# Altium schematic sheet Power_Sheet.SchDoc: Power Sheet
size A4; DrawnBy: Project_Vega_Team; Revision: 1; SheetNumber: 3; SheetTotal: 7
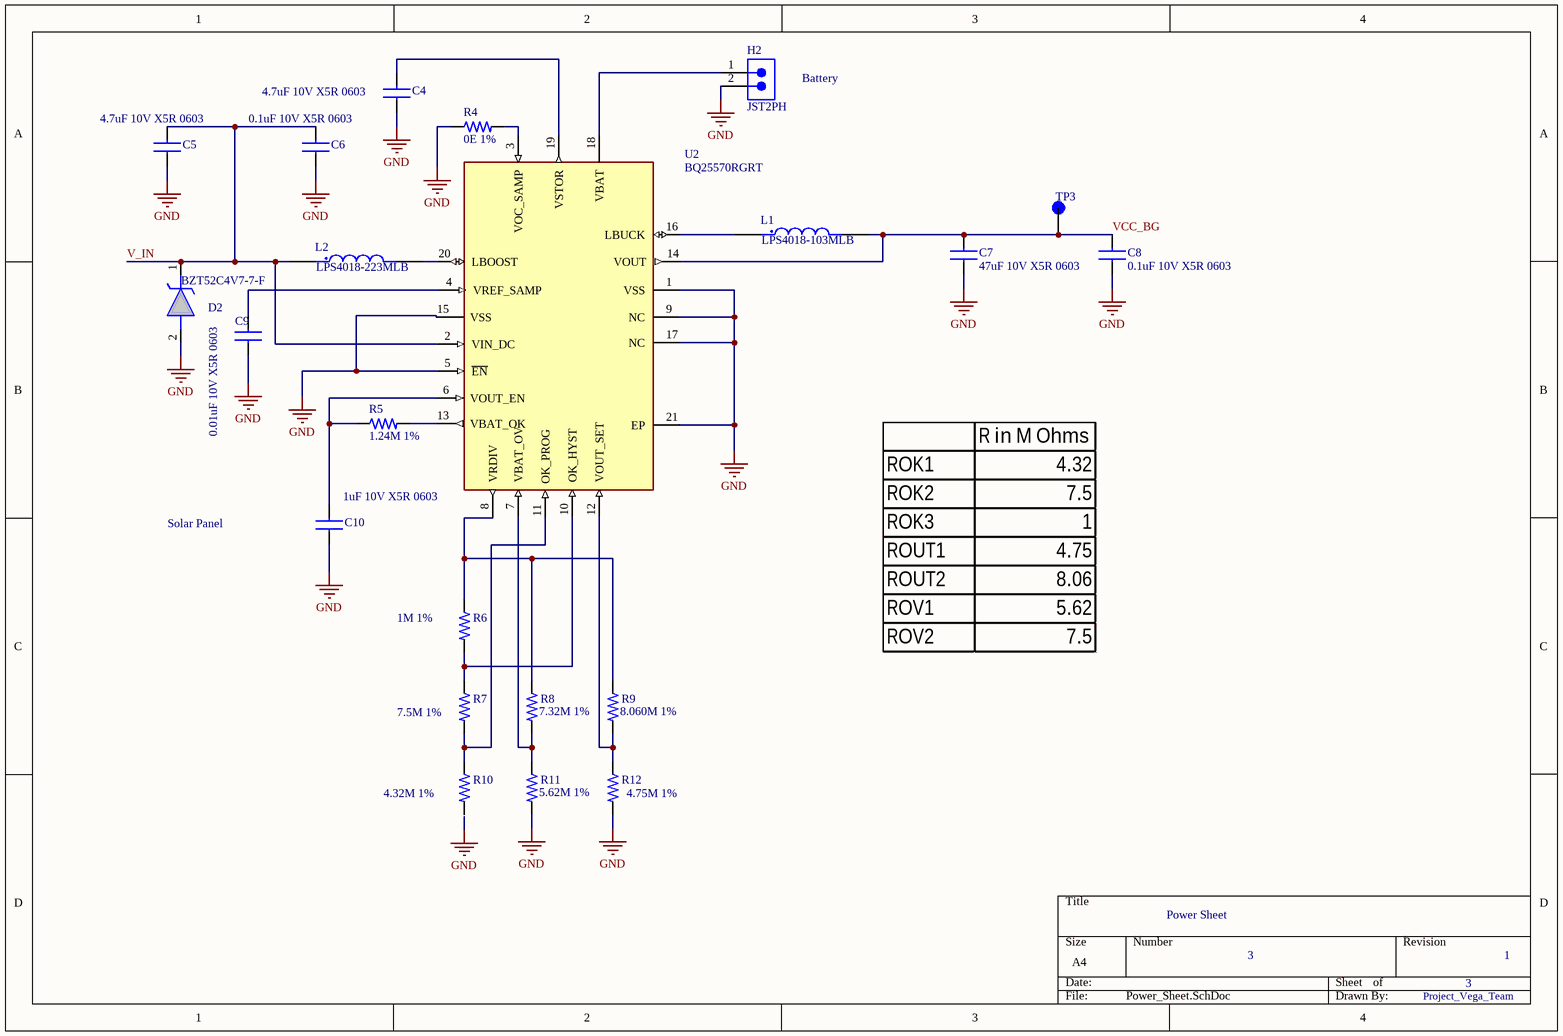
[diagram p0: Power_Sheet.SchDoc]

## Parts
C4  4.7uF 10V X5R 0603  [CAP_0603_1MM]
C5  4.7uF 10V X5R 0603  [CAP_0603_1MM]
C6  0.1uF 10V X5R 0603  [CAP_0603_1MM]
C7  47uF 10V X5R 0603  [CAP_0603_1MM]
C8  0.1uF 10V X5R 0603  [CAP_0603_1MM]
C9  0.01uF 10V X5R 0603  [CAP_0603_1MM]
C10  1uF 10V X5R 0603  [CAP_0603_1MM]
D2  BZT52C4V7-7-F  [SOD3716X145N]
H2  JST2PH  [JST_B2B-PH-K-S(LF)(SN)]
L1  LPS4018-103MLB  [IND_LPS4018-223MRC]
L2  LPS4018-223MLB  [IND_LPS4018-223MRC]
R4  0E 1%  [RES_0603_1608X06]
R5  1.24M 1%  [RES_0603_1608X06]
R6  1M 1%  [RES_0603_1608X06]
R7  7.5M 1%  [RES_0603_1608X06]
R8  7.32M 1%  [RES_0603_1608X06]
R9  8.060M 1%  [RES_0603_1608X06]
R10  4.32M 1%  [RES_0603_1608X06]
R11  5.62M 1%  [RES_0603_1608X06]
R12  4.75M 1%  [RES_0603_1608X06]
TP3  Test_point  [TP]  (value not drawn)
U2  BQ25570RGRT  [QFN50P350X350X100-21N]

## Nets
GND: C4.1 C5.1 C6.1 C7.1 C8.1 C9.1 C10.1 D2.2(A) H2.2 R4.1 R11.2 R12.2 U2.1(VSS) U2.5(~{EN}) U2.9(NC) U2.15(VSS) U2.17(NC) U2.21(EP)
V_IN: C5.2 C6.2 D2.1(K) L2.1 U2.2(VIN_DC)
VCC_BG: C7.2 C8.2 L1.2 TP3.TP U2.14(VOUT)
NetC4_2: C4.2 U2.19(VSTOR)
NetC9_2: C9.2 U2.4(VREF_SAMP)
NetC10_2: C10.2 R5.1 U2.6(VOUT_EN)
NetH2_1: H2.1 U2.18(VBAT)
NetL1_1: L1.1 U2.16(LBUCK)
NetL2_2: L2.2 U2.20(LBOOST)
NetR4_2: R4.2 U2.3(VOC_SAMP)
NetR5_2: R5.2 U2.13(VBAT_OK)
NetR6_1: R6.1 R8.1 R9.1 U2.8(VRDIV)
NetR6_2: R6.2 R7.1 U2.10(OK_HYST)
NetR7_2: R7.2 R10.1 U2.11(OK_PROG)
NetR8_2: R8.2 R11.1 U2.7(VBAT_OV)
NetR9_2: R9.2 R12.1 U2.12(VOUT_SET)

Not connected (* = marked no-connect by the designer): R10 2

## Notes on the sheet
- Battery
- Solar Panel

## Library data of the parts
C4-C10 = GRM188R61A226ME15D: CAP CER 22UF 10V X5R 0603; Manufacturer: Murata; Voltage Rating DC: 10 VDC; Tolerance: 20 %; Brand: Murata Electronics; Type: Voltage and Temperature Derating Recommended Product; Unit Weight: 0.000222 oz; Supplier 1: Digi-Key; Supplier Part Number 1: 490-10476-1-ND; Manufacturer Part Number: GRM188R61A226ME15D; Stock 1: 849458; Pricing 1: 1=0.33, 10=0.226, 50=0.1506, 100=0.1279, 500=0.0903, 1000=0.079 (USD); Product Category: Multilayer Ceramic Capacitors MLCC - SMD/SMT; RoHS: True; Capacitance: 22 uF; Dielectric: X5R; Case Code - in: 0603; Case Code - mm: 1608; Height: 0.8 mm; Maximum Operating Temperature: + 85 C; Minimum Operating Temperature: - 55 C; Product: General Type MLCCs; Series: GRM; Packaging: Reel; Length: 1.6 mm; Package / Case: 0603 (1608 metric); Factory Pack Quantity: 4000; Termination Style: SMD/SMT; Width: 0.8 mm; ComponentLink1URL: http://www.farnell.com/datasheets/2047978.pdf?src-supplier=Element14; ComponentLink1Description: http://www.farnell.com/datasheets/2047978.pdf?src-supplier=Element14
D2 = BZT52C4V7-7-F: Diodes Inc BZT52C4V7-7-F Zener Diode, 4.7V 7% 500 mW SMT 2-Pin SOD-123; Manufacturer_Name: Diodes Incorporated; Geometry.Height: 1.45mm; Manufacturer_Part_Number: BZT52C4V7-7-F; Mouser Part Number: 621-BZT52C4V7-F; Mouser Price/Stock: https://www.mouser.co.uk/ProductDetail/Diodes-Incorporated/BZT52C4V7-7-F?qs=J8U5V1LGimN8O12FVAOKUQ%3D%3D; Arrow Part Number: BZT52C4V7-7-F; Arrow Price/Stock: https://www.arrow.com/en/products/bzt52c4v7-7-f/diodes-incorporated?region=nac; Datasheet Link: https://www.diodes.com/assets/Datasheets/ds18004.pdf
H2 = JST2PH: Connector Header Through Hole 2 position 0.079" (2.00mm); Manufacturer: JST; Manufacturer Part Number: B2B-PH-K-S; Supplier: Digi-Key; Supplier Part Number: 455-1704-ND; RoHS: Yes; Category: Connectors; Stock: 1077617; Pricing: 1=0.19, 10=0.147, 100=0.1088, 500=0.09006, 1000=0.0788, 5000=0.06754, 10000=0.06567 (USD); ComponentLink1URL: https://datasheet.ciiva.com/6905/phseries-6905929.pdf?src-supplier=Digi-Key; ComponentLink1Description: https://datasheet.ciiva.com/6905/phseries-6905929.pdf?src-supplier=Digi-Key
L1 L2 = LPS4018-223MRC: 22 µH Shielded Drum Core Inductor 650 mA 360mOhm Max Nonstandard; MF: Coilcraft; SnapEDA_Link: https://www.snapeda.com/parts/LPS4018-223MRC/Coilcraft/view-part/?ref=snap; Package: None; Value: *; MP: LPS4018-223MRC; Check_prices: https://www.snapeda.com/parts/LPS4018-223MRC/Coilcraft/view-part/?ref=eda
R4-R12 = RC0603FR-07316KL: SMD Chip Resistor, 316 kOhm, ± 1%, 100 mW, 0603 [1608 Metric], Thick Film, General Purpose; Manufacturer: Yageo; Value: 316kR; Power Rating: 100mW; Voltage Rating: 50V; Temperature Coefficient: 100ppm/°C; Supplier: Digikey; Supplier Part Number: 311-316KHRCT-ND; Manufacturer Part Number: RC0603FR-07316KL; RoHS: Yes; Category: Chip SMD Resistors; Stock: 149463; Pricing: 1=0.1, 10=0.019, 50=0.0112, 100=0.0093, 500=0.00622, 1000=0.00532 (USD); Mounting Technology: Surface Mount; Case/Package: 0603; Case Code (Imperial): 0603; Case Code (Metric): 1608; Min Operating Temperature: -55°C; Max Operating Temperature: 155°C; Tolerance: 1%; Packaging: Tape and Reel; Termination: SMD/SMT; Number of Terminations: 2; Max Power Dissipation: 100mW; Voltage Rating (DC): 50V; Features: Moisture Resistant; Series: RC; Lead Free: Lead Free; RoHS Compliant: Yes; ComponentLink1URL: https://datasheet.ciiva.com/2454/pyu-r-int-thick-7-2454966.pdf?src-supplier=Digikey; ComponentLink1Description: https://datasheet.ciiva.com/2454/pyu-r-int-thick-7-2454966.pdf?src-supplier=Digikey; ComponentLink2URL: https://datasheet.ciiva.com/2454/pyu-r-int-thick-7-2454967.pdf?src-supplier=Digikey; ComponentLink2Description: https://datasheet.ciiva.com/2454/pyu-r-int-thick-7-2454967.pdf?src-supplier=Digikey; ComponentLink3URL: https://datasheet.ciiva.com/2454/pyu-r-int-thick-7-2454968.pdf?src-supplier=Digikey; ComponentLink3Description: https://datasheet.ciiva.com/2454/pyu-r-int-thick-7-2454968.pdf?src-supplier=Digikey
TP3 = Test_point: SMT Test Point- Mininature-1000 pc Reels; MP: 5019; MF: Keystone Electronics; Value: *; Availability: In Stock; Purchase-URL: https://pricing.snapeda.com/search/part/5019/?ref=eda; Package: None; Price: None
U2 = BQ25570RGRT: Ultra Low power Harvester power Management IC with boost charger, and Nanopower Buck Converter 20-VQFN -40 to 125; MF: Texas Instruments; Availability: Warning; SnapEDA_Link: https://www.snapeda.com/parts/BQ25570RGRT/Texas%20Instruments/view-part/49255/?ref=snap; MP: BQ25570RGRT; Value: *; Price: None; Package: VQFN-20 Texas Instruments; Purchase-URL: https://pricing.snapeda.com/search/part/BQ25570RGRT/?ref=eda; Check_prices: https://www.snapeda.com/parts/BQ25570RGRT/Texas%20Instruments/view-part/49255/?ref=eda; Supplier 1: Digikey; Supplier Part Number 1: 296-37014-1-ND